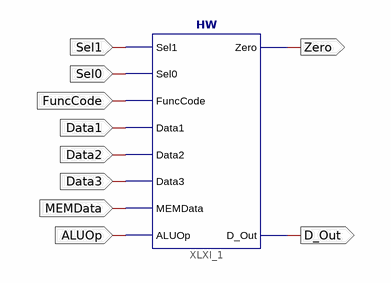
[diagram p0: schematic sheet 1]
// Xilinx ISE schematic HW.sch (artix7) as structural Verilog: 1 symbols, 10 ports
module HW (
  input  Sel1,
  input  Sel0,
  input  FuncCode,
  input  Data1,
  input  Data2,
  input  Data3,
  input  MEMData,
  input  ALUOp,
  output D_Out,
  output Zero
);

  HW XLXI_1 (
    .Sel1(Sel1), .Sel0(Sel0), .FuncCode(FuncCode), .Data1(Data1), .Data2(Data2), .Data3(Data3),
    .MEMData(MEMData), .ALUOp(ALUOp), .Zero(Zero), .D_Out(D_Out));
endmodule
